# Altium schematic sheet 70.SchDoc
size 420 x 297 mm
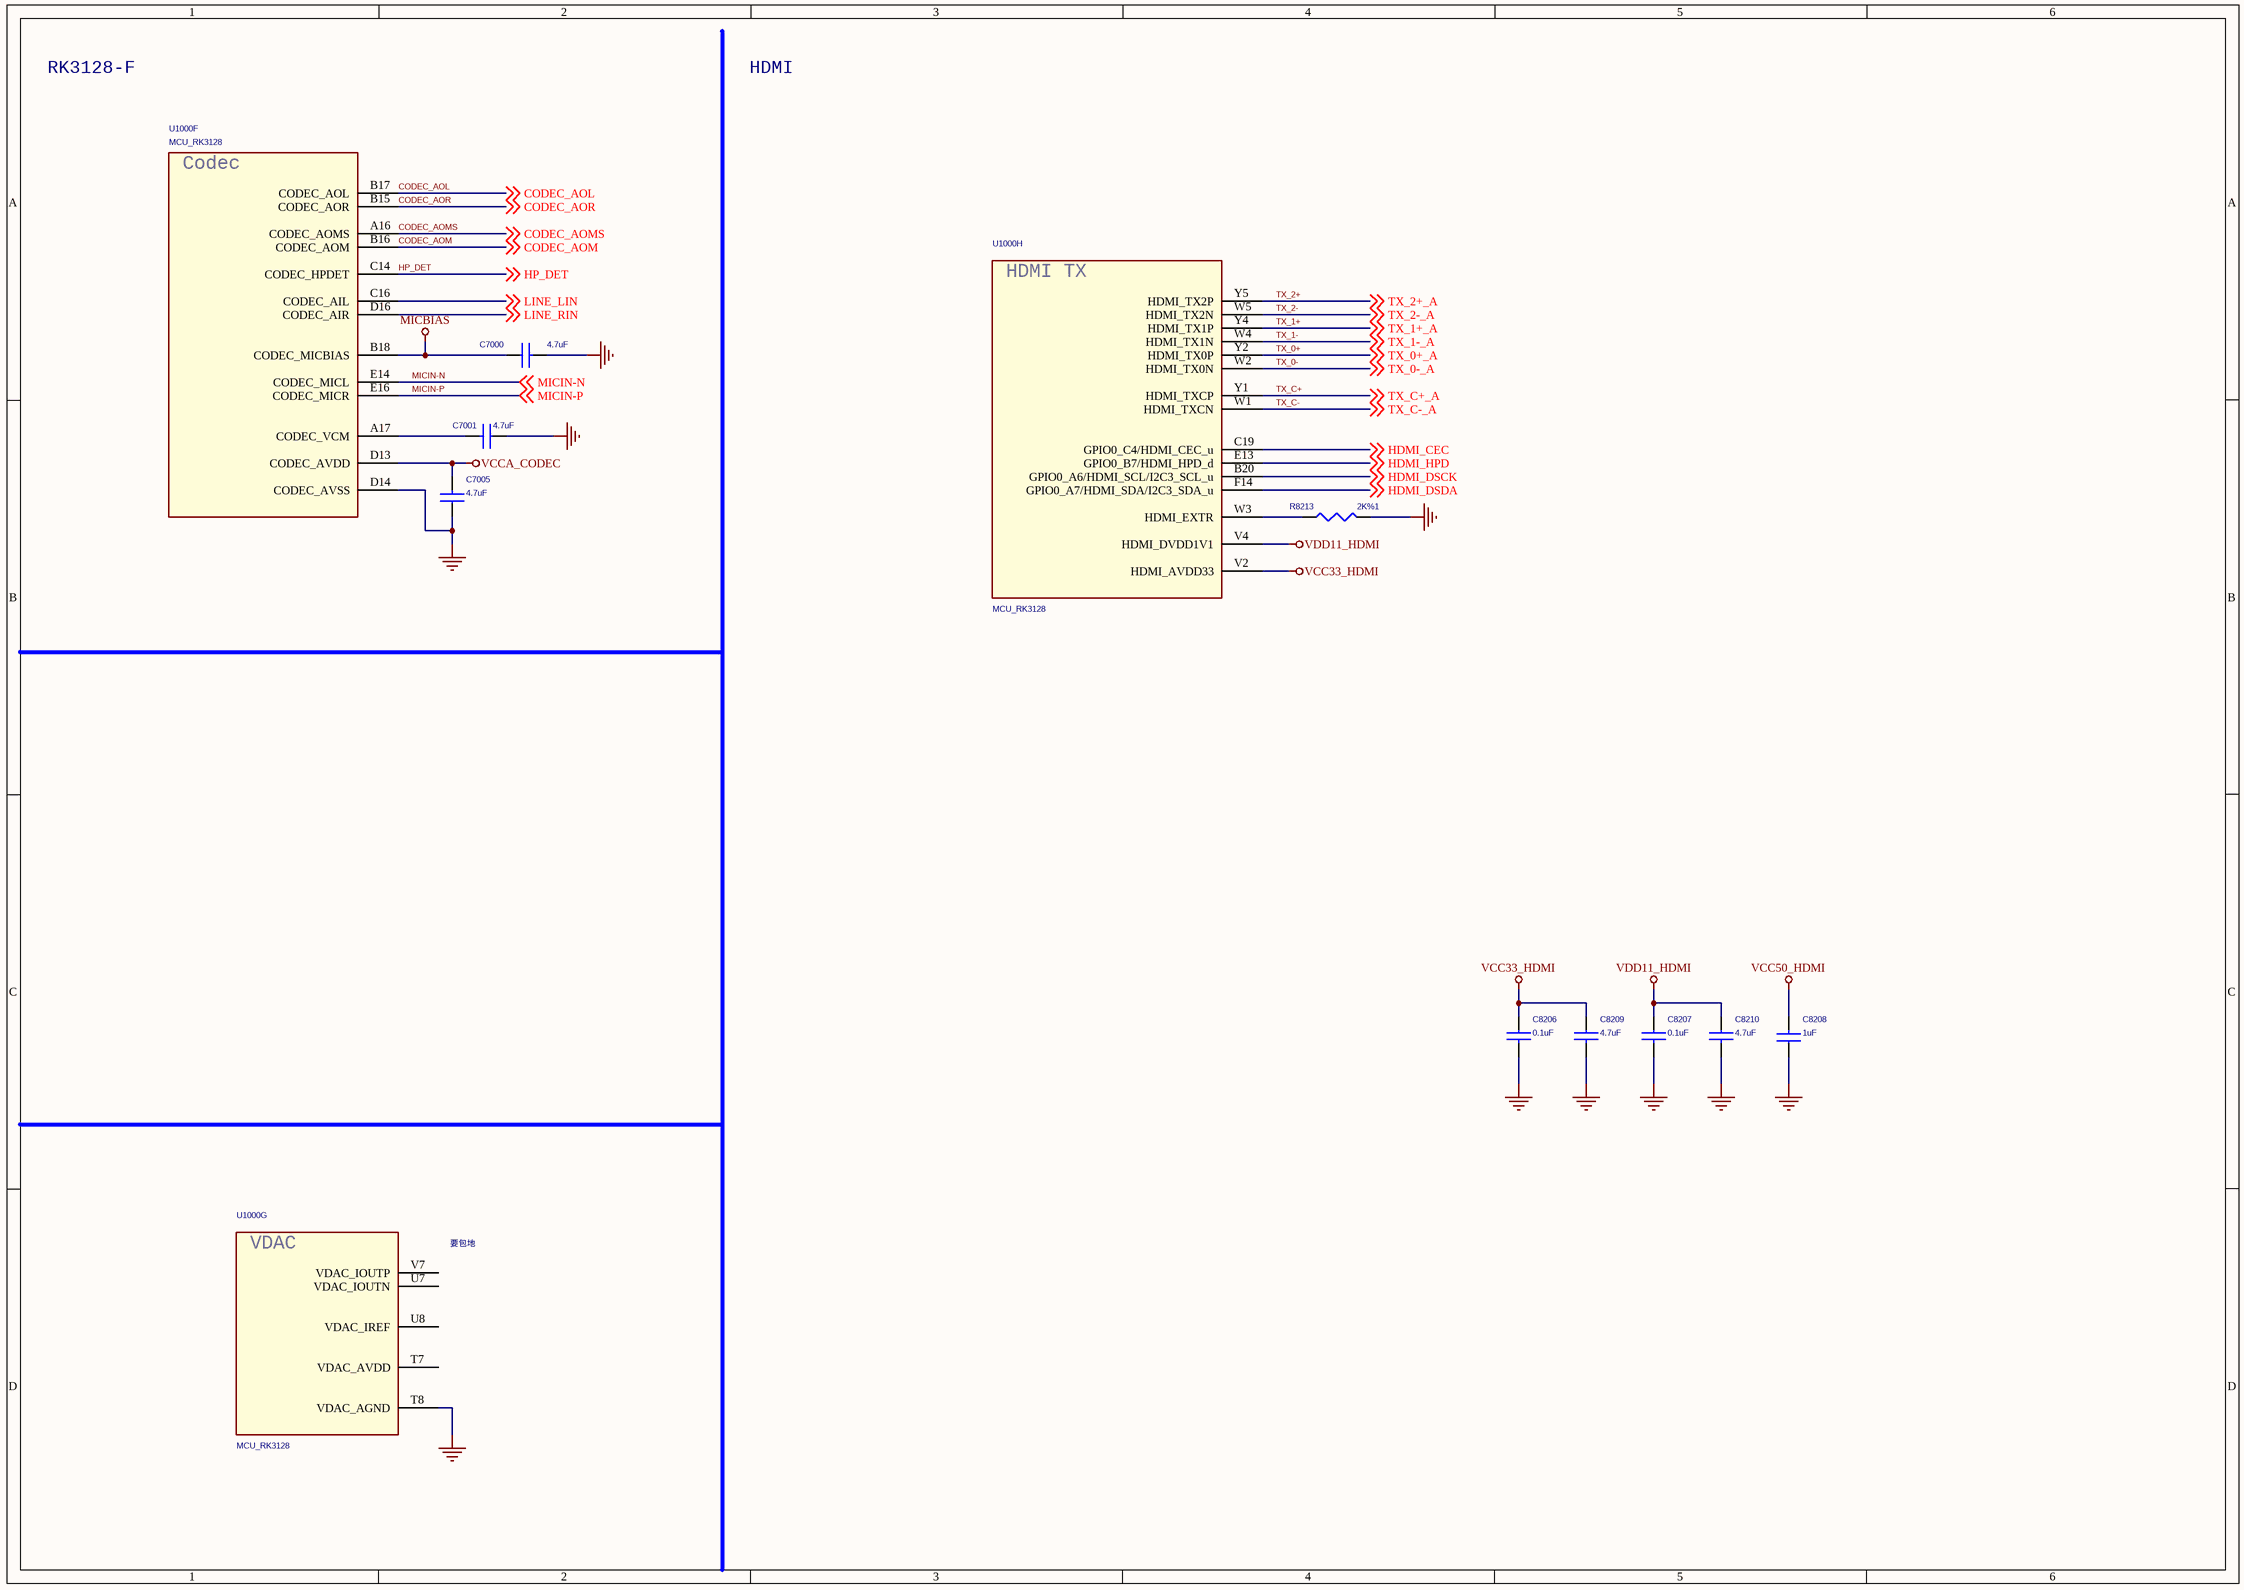
[diagram p0: 70.SchDoc]

## Parts
C7000  4.7uF  [C0402]
C7001  4.7uF  [C0402]
C7005  4.7uF  [C0402]
C8206  0.1uF  [C0402]
C8207  0.1uF  [C0402]
C8208  1uF  [C0402]
C8209  4.7uF  [C0402]
C8210  4.7uF  [C0402]
R8213  2K%1  [R0402]
U1000  MCU_RK3128  [BGA316-14X14-0.65]  (parts F,G,H of 12)

## Nets
GND: C7000.2 C7001.1 C7005.1 C8206.2 C8207.2 C8208.1 C8209.2 C8210.2 R8213.1 U1000.D14(CODEC_AVSS) U1000.T8(VDAC_AGND)
MICBIAS: C7000.1 U1000.B18(CODEC_MICBIAS)
VCC33_HDMI: C8206.1 C8209.1 U1000.V2(HDMI_AVDD33)
VCC50_HDMI: C8208.2
VCCA_CODEC: C7005.2 U1000.D13(CODEC_AVDD)
VDD11_HDMI: C8207.1 C8210.1 U1000.V4(HDMI_DVDD1V1)
CODEC_AOL: U1000.B17(CODEC_AOL) ; off-sheet CODEC_AOL
CODEC_AOM: U1000.B16(CODEC_AOM) ; off-sheet CODEC_AOM
CODEC_AOMS: U1000.A16(CODEC_AOMS) ; off-sheet CODEC_AOMS
CODEC_AOR: U1000.B15(CODEC_AOR) ; off-sheet CODEC_AOR
HDMI_CEC: U1000.C19(GPIO0_C4/HDMI_CEC_u) ; off-sheet HDMI_CEC
HDMI_DSCK: U1000.B20(GPIO0_A6/HDMI_SCL/I2C3_SCL_u) ; off-sheet HDMI_DSCK
HDMI_DSDA: U1000.F14(GPIO0_A7/HDMI_SDA/I2C3_SDA_u) ; off-sheet HDMI_DSDA
HDMI_HPD: U1000.E13(GPIO0_B7/HDMI_HPD_d) ; off-sheet HDMI_HPD
HP_DET: U1000.C14(CODEC_HPDET) ; off-sheet HP_DET
LINE_LIN: U1000.C16(CODEC_AIL) ; off-sheet LINE_LIN
LINE_RIN: U1000.D16(CODEC_AIR) ; off-sheet LINE_RIN
MICIN-N: U1000.E14(CODEC_MICL) ; off-sheet MICIN-N
MICIN-P: U1000.E16(CODEC_MICR) ; off-sheet MICIN-P
TX_0+: U1000.Y2(HDMI_TX0P) ; off-sheet TX_0+_A  [also labelled TX_0+_A]
TX_0-: U1000.W2(HDMI_TX0N) ; off-sheet TX_0-_A  [also labelled TX_0-_A]
TX_1+: U1000.Y4(HDMI_TX1P) ; off-sheet TX_1+_A  [also labelled TX_1+_A]
TX_1-: U1000.W4(HDMI_TX1N) ; off-sheet TX_1-_A  [also labelled TX_1-_A]
TX_2+: U1000.Y5(HDMI_TX2P) ; off-sheet TX_2+_A  [also labelled TX_2+_A]
TX_2-: U1000.W5(HDMI_TX2N) ; off-sheet TX_2-_A  [also labelled TX_2-_A]
TX_C+: U1000.Y1(HDMI_TXCP) ; off-sheet TX_C+_A  [also labelled TX_C+_A]
TX_C-: U1000.W1(HDMI_TXCN) ; off-sheet TX_C-_A  [also labelled TX_C-_A]
NetC7001_2: C7001.2 U1000.A17(CODEC_VCM)
NetR8213_2: R8213.2 U1000.W3(HDMI_EXTR)

Not connected (* = marked no-connect by the designer): U1000 T7(VDAC_AVDD) U7(VDAC_IOUTN) U8(VDAC_IREF) V7(VDAC_IOUTP)

## Notes on the sheet
- RK3128-F
- HDMI
- 要包地
- (in symbol MCU_RK3128, part F) Codec
- (in symbol MCU_RK3128, part G) VDAC
- (in symbol MCU_RK3128, part H) HDMI TX

## Library data of the parts
C7000 C8206 C8207 C8209 C8210 = CAP NP
C7001 = CAP NP: CAP,MLCC,10uF,+/-10%,X5R,16V,SMD0805
C7005 = CAP NP: RoHS CHIP CAP 0.1uF +10/-10% X7R
C8208 = CAP NP: RoHS CHIP CAP 1uF +10/-10% X5R
R8213 = RESISTOR_0: RES,thick film,3.5KOhm,+/-5%,1/16W,SMD0402